# Altium schematic sheet 2017-01-30_01-57-481.schdoc
size 422 x 220 mm; SheetNumber: 1; SheetTotal: 1
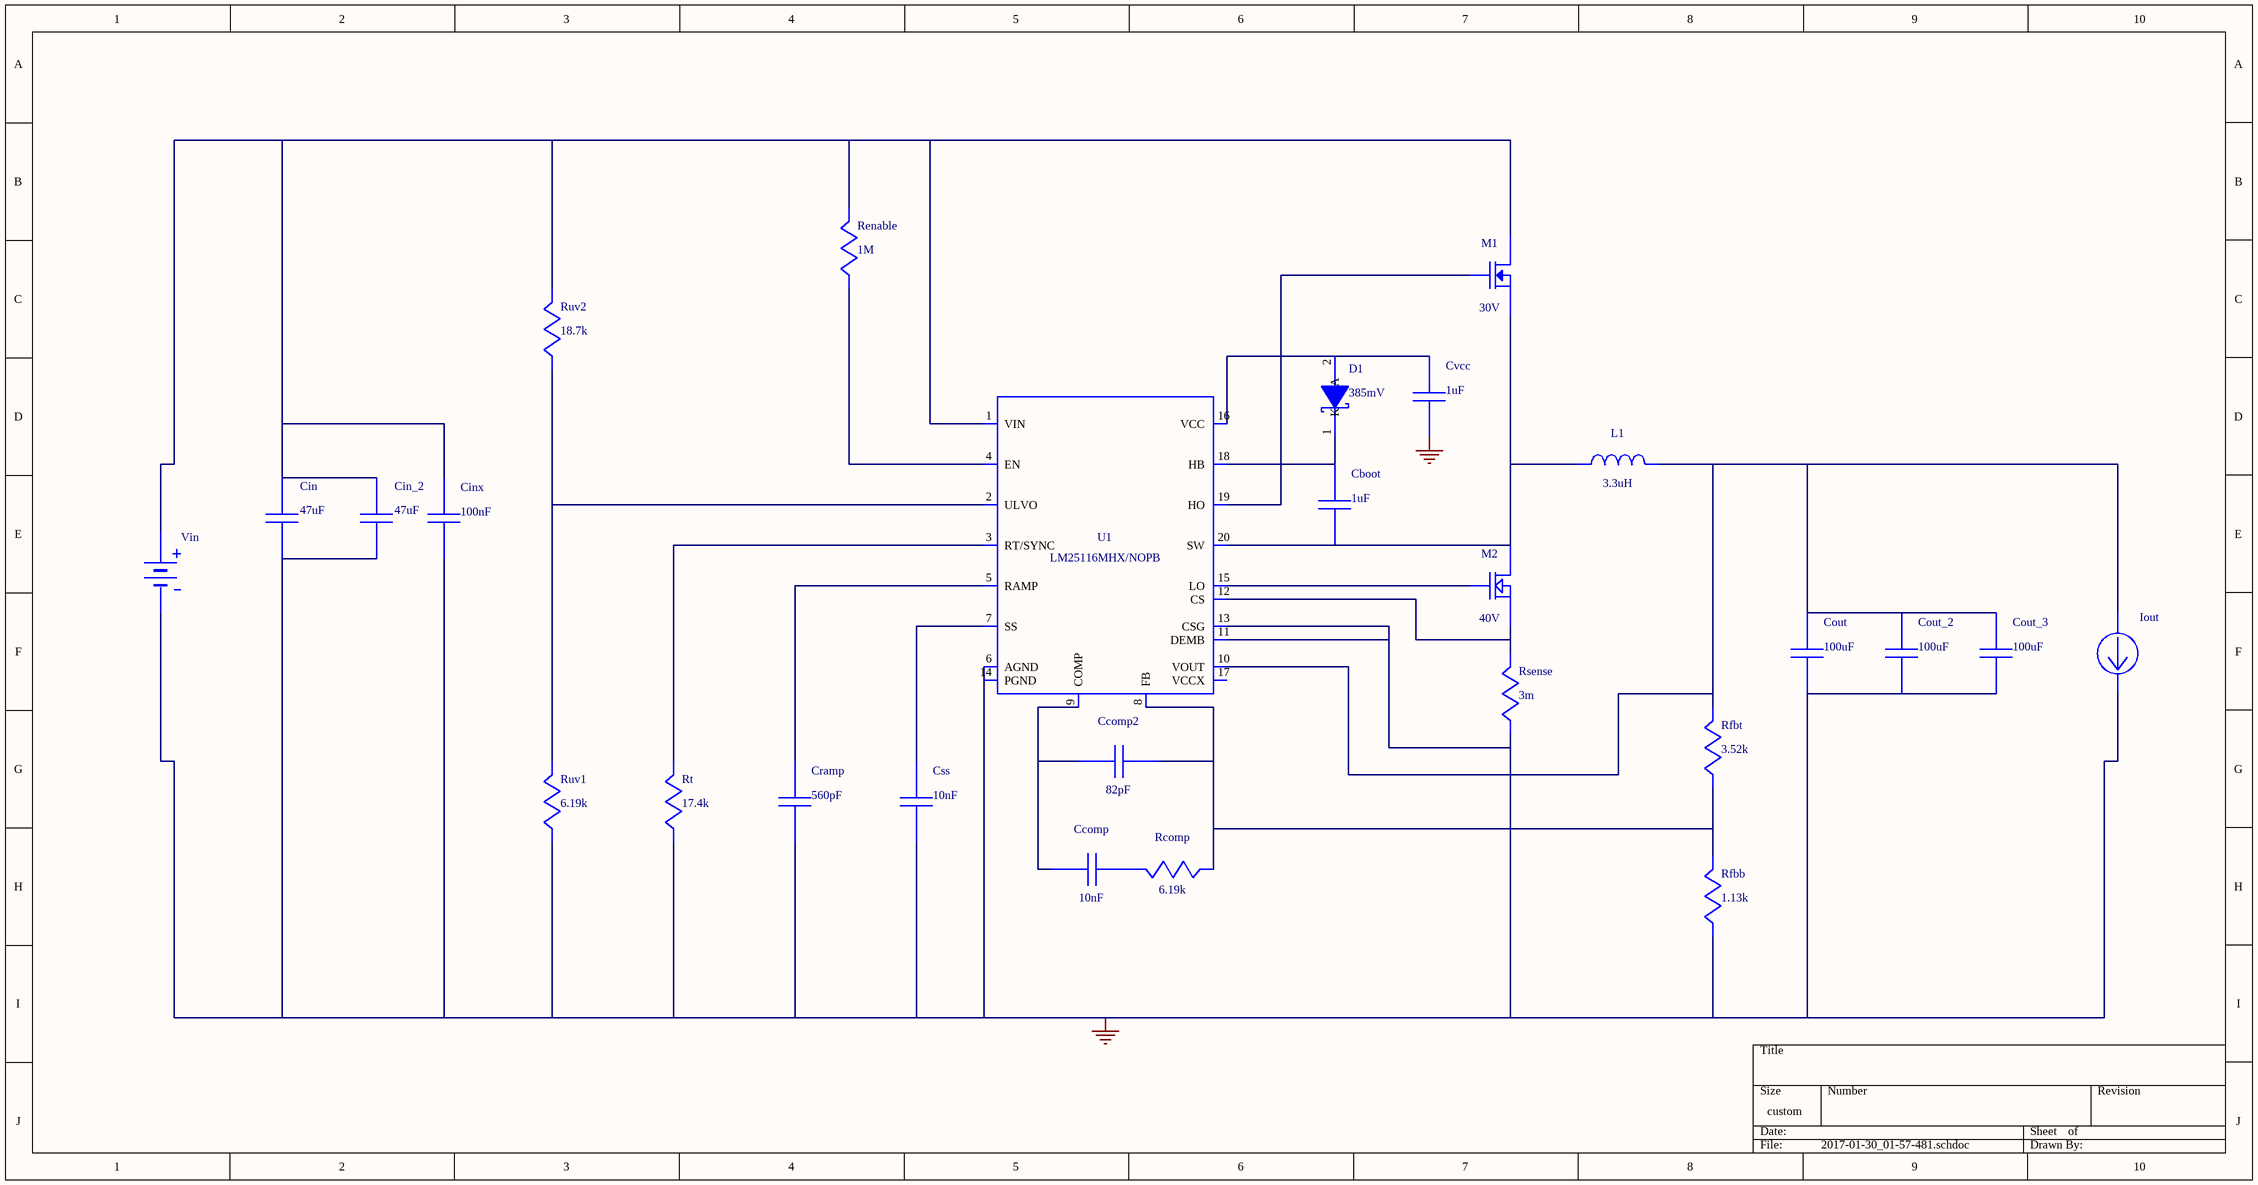
[diagram p0: 2017-01-30_01-57-481.schdoc]

## Parts
Cboot  value 1uF  (hidden comment: EMK212B7105KG-T)
Ccomp  value 10nF  (hidden comment: CC0805KRX7R9BB103)
Ccomp2  value 82pF  (hidden comment: CC0805JRNPO9BN820)
Cin  value 47uF  (hidden comment: C3216X5R1E476M160AC)
Cin_2  value 47uF  (hidden comment: C3216X5R1E476M160AC)
Cinx  value 100nF  (hidden comment: 08053C104KAT2A)
Cout  value 100uF  (hidden comment: GRM31CR60J107ME39L)
Cout_2  value 100uF  (hidden comment: GRM31CR60J107ME39L)
Cout_3  value 100uF  (hidden comment: GRM31CR60J107ME39L)
Cramp  value 560pF  (hidden comment: CL21C561JBANFNC)
Css  value 10nF  (hidden comment: CC0805KRX7R9BB103)
Cvcc  value 1uF  (hidden comment: EMK212B7105KG-T)
D1  value 385mV  (hidden comment: CDBK0520L)
Iout  WB_CURRENT_LOAD  (value not drawn)
L1  value 3.3uH  (hidden comment: IHLP6767DZER3R3M11)
M1  value 30V  (hidden comment: RJK0330DPB)
M2  value 40V  (hidden comment: PSMN4R0-40YS)
Rcomp  value 6.19k  (hidden comment: ERJ-6ENF6191V)
Renable  value 1M  (hidden comment: ERJ-6ENF1004V)
Rfbb  value 1.13k  (hidden comment: ERJ-6ENF1131V)
Rfbt  value 3.52k  (hidden comment: RT0805BRD073K52L)
Rsense  value 3m  (hidden comment: CSNL1206FT3L00)
Rt  value 17.4k  (hidden comment: ERJ-6ENF1742V)
Ruv1  value 6.19k  (hidden comment: ERJ-6ENF6191V)
Ruv2  value 18.7k  (hidden comment: ERJ-6ENF1872V)
U1  LM25116MHX/NOPB
Vin  WB_BATTERY  (value not drawn)

## Nets
0: Cin.2 Cin_2.2 Cinx.2 Cout.2 Cout_2.2 Cout_3.2 Cramp.2 Css.2 Cvcc.2 Iout.2(-) Rfbb.2 Rsense.2 Rt.2 Ruv1.2 U1.6(AGND) U1.11(DEMB) U1.13(CSG) U1.14(PGND) U1.21(EP) Vin.2(-)
NetCboot_1: Cboot.1 D1.1(K) U1.18(HB)
NetCboot_2: Cboot.2 L1.1 M1.1(Source) M1.2(Source) M1.3(Source) M2.5(Drain) M2.6(Drain) U1.20(SW)
NetCcomp2_2: Ccomp2.2 Rcomp.2 Rfbb.1 Rfbt.2 U1.8(FB)
NetCcomp_1: Ccomp.1 Ccomp2.1 U1.9(COMP)
NetCcomp_2: Ccomp.2 Rcomp.1
NetCin_1: Cin.1 Cin_2.1 Cinx.1 M1.5(Drain) M1.6(Drain) Renable.1 Ruv2.1 U1.1(VIN) Vin.1(+)
NetCout_1: Cout.1 Cout_2.1 Cout_3.1 Iout.1(+) L1.2 Rfbt.1 U1.10(VOUT)
NetCramp_1: Cramp.1 U1.5(RAMP)
NetCss_1: Css.1 U1.7(SS)
NetCvcc_1: Cvcc.1 D1.2(A) U1.16(VCC)
NetM1_4: M1.4(Gate) U1.19(HO)
NetM2_1: M2.1(Source) M2.2(Source) M2.3(Source) Rsense.1 U1.12(CS)
NetM2_4: M2.4(Gate) U1.15(LO)
NetRenable_2: Renable.2 U1.4(EN)
NetRt_1: Rt.1 U1.3(RT/SYNC)
NetRuv1_1: Ruv1.1 Ruv2.2 U1.2(ULVO)

Not connected (* = marked no-connect by the designer): U1 17(VCCX)

## Library data of the parts
Cboot Cvcc = EMK212B7105KG-T: Manufacturer Name: Taiyo Yuden; PackageReference: EMK212B7105KG-T; Manufacturer Part Number: EMK212B7105KG-T
Ccomp Css = CC0805KRX7R9BB103: CC0805KRX7R9BB10; Manufacturer Name: Yageo America; PackageReference: CC0805KRX7R9BB103; Manufacturer Part Number: CC0805KRX7R9BB103
Ccomp2 = CC0805JRNPO9BN820: CC0805JRNPO9BN82; Manufacturer Name: Yageo America; PackageReference: CC0805JRNPO9BN820; Manufacturer Part Number: CC0805JRNPO9BN820
Cin Cin_2 = C3216X5R1E476M160AC: C3216X5R1E476M16; Manufacturer Name: TDK; PackageReference: C3216X5R1E476M160AC; Manufacturer Part Number: C3216X5R1E476M160AC
Cinx = 08053C104KAT2A: Manufacturer Name: AVX; PackageReference: 08053C104KAT2A; Manufacturer Part Number: 08053C104KAT2A
Cout Cout_2 Cout_3 = GRM31CR60J107ME39L: GRM31CR60J107ME3; Manufacturer Name: MuRata; PackageReference: GRM31CR60J107ME39L; Manufacturer Part Number: GRM31CR60J107ME39L
Cramp = CL21C561JBANFNC: Manufacturer Name: Samsung Electro-Mechanics; PackageReference: CL21C561JBANFNC; Manufacturer Part Number: CL21C561JBANFNC
D1 = CDBK0520L: Manufacturer Name: Comchip Technology; PackageReference: CDBK0520L; Manufacturer Part Number: CDBK0520L
L1 = IHLP6767DZER3R3M11: Unknown; Manufacturer Name: Vishay-Dale; PackageReference: IHLP6767DZER3R3M11; Manufacturer Part Number: IHLP6767DZER3R3M11
M1 = RJK0330DPB: Manufacturer Name: Renesas; PackageReference: RJK0330DPB; Manufacturer Part Number: RJK0330DPB
M2 = PSMN4R0-40YS: Manufacturer Name: NXP Semiconductor; PackageReference: PSMN4R0-40YS; Manufacturer Part Number: PSMN4R0-40YS
Rcomp Ruv1 = ERJ-6ENF6191V: Manufacturer Name: Panasonic; PackageReference: ERJ-6ENF6191V; Manufacturer Part Number: ERJ-6ENF6191V
Renable = ERJ-6ENF1004V: Manufacturer Name: Panasonic; PackageReference: ERJ-6ENF1004V; Manufacturer Part Number: ERJ-6ENF1004V
Rfbb = ERJ-6ENF1131V: Manufacturer Name: Panasonic; PackageReference: ERJ-6ENF1131V; Manufacturer Part Number: ERJ-6ENF1131V
Rfbt = RT0805BRD073K52L: Manufacturer Name: Yageo America; PackageReference: RT0805BRD073K52L; Manufacturer Part Number: RT0805BRD073K52L
Rsense = CSNL1206FT3L00: Manufacturer Name: Stackpole Electronics Inc; PackageReference: CSNL1206FT3L00; Manufacturer Part Number: CSNL1206FT3L00
Rt = ERJ-6ENF1742V: Manufacturer Name: Panasonic; PackageReference: ERJ-6ENF1742V; Manufacturer Part Number: ERJ-6ENF1742V
Ruv2 = ERJ-6ENF1872V: Manufacturer Name: Panasonic; PackageReference: ERJ-6ENF1872V; Manufacturer Part Number: ERJ-6ENF1872V
U1 = LM25116MHX/NOPB: Manufacturer Name: Texas Instruments; PackageReference: LM25116MHX/NOPB; Manufacturer Part Number: LM25116MHX/NOPB; Value: N/A
Iout = WB_CURRENT_LOAD: PackageReference: WB_CURRENT_LOAD; Manufacturer Part Number: WB_CURRENT_LOAD; Manufacturer Name: WB_CURRENT_LOAD; Value: N/A
Vin = WB_BATTERY: PackageReference: WB_BATTERY; Manufacturer Part Number: WB_BATTERY; Manufacturer Name: WB_BATTERY; Value: N/A